# Altium project LED_12T-V2.0.PrjPCB
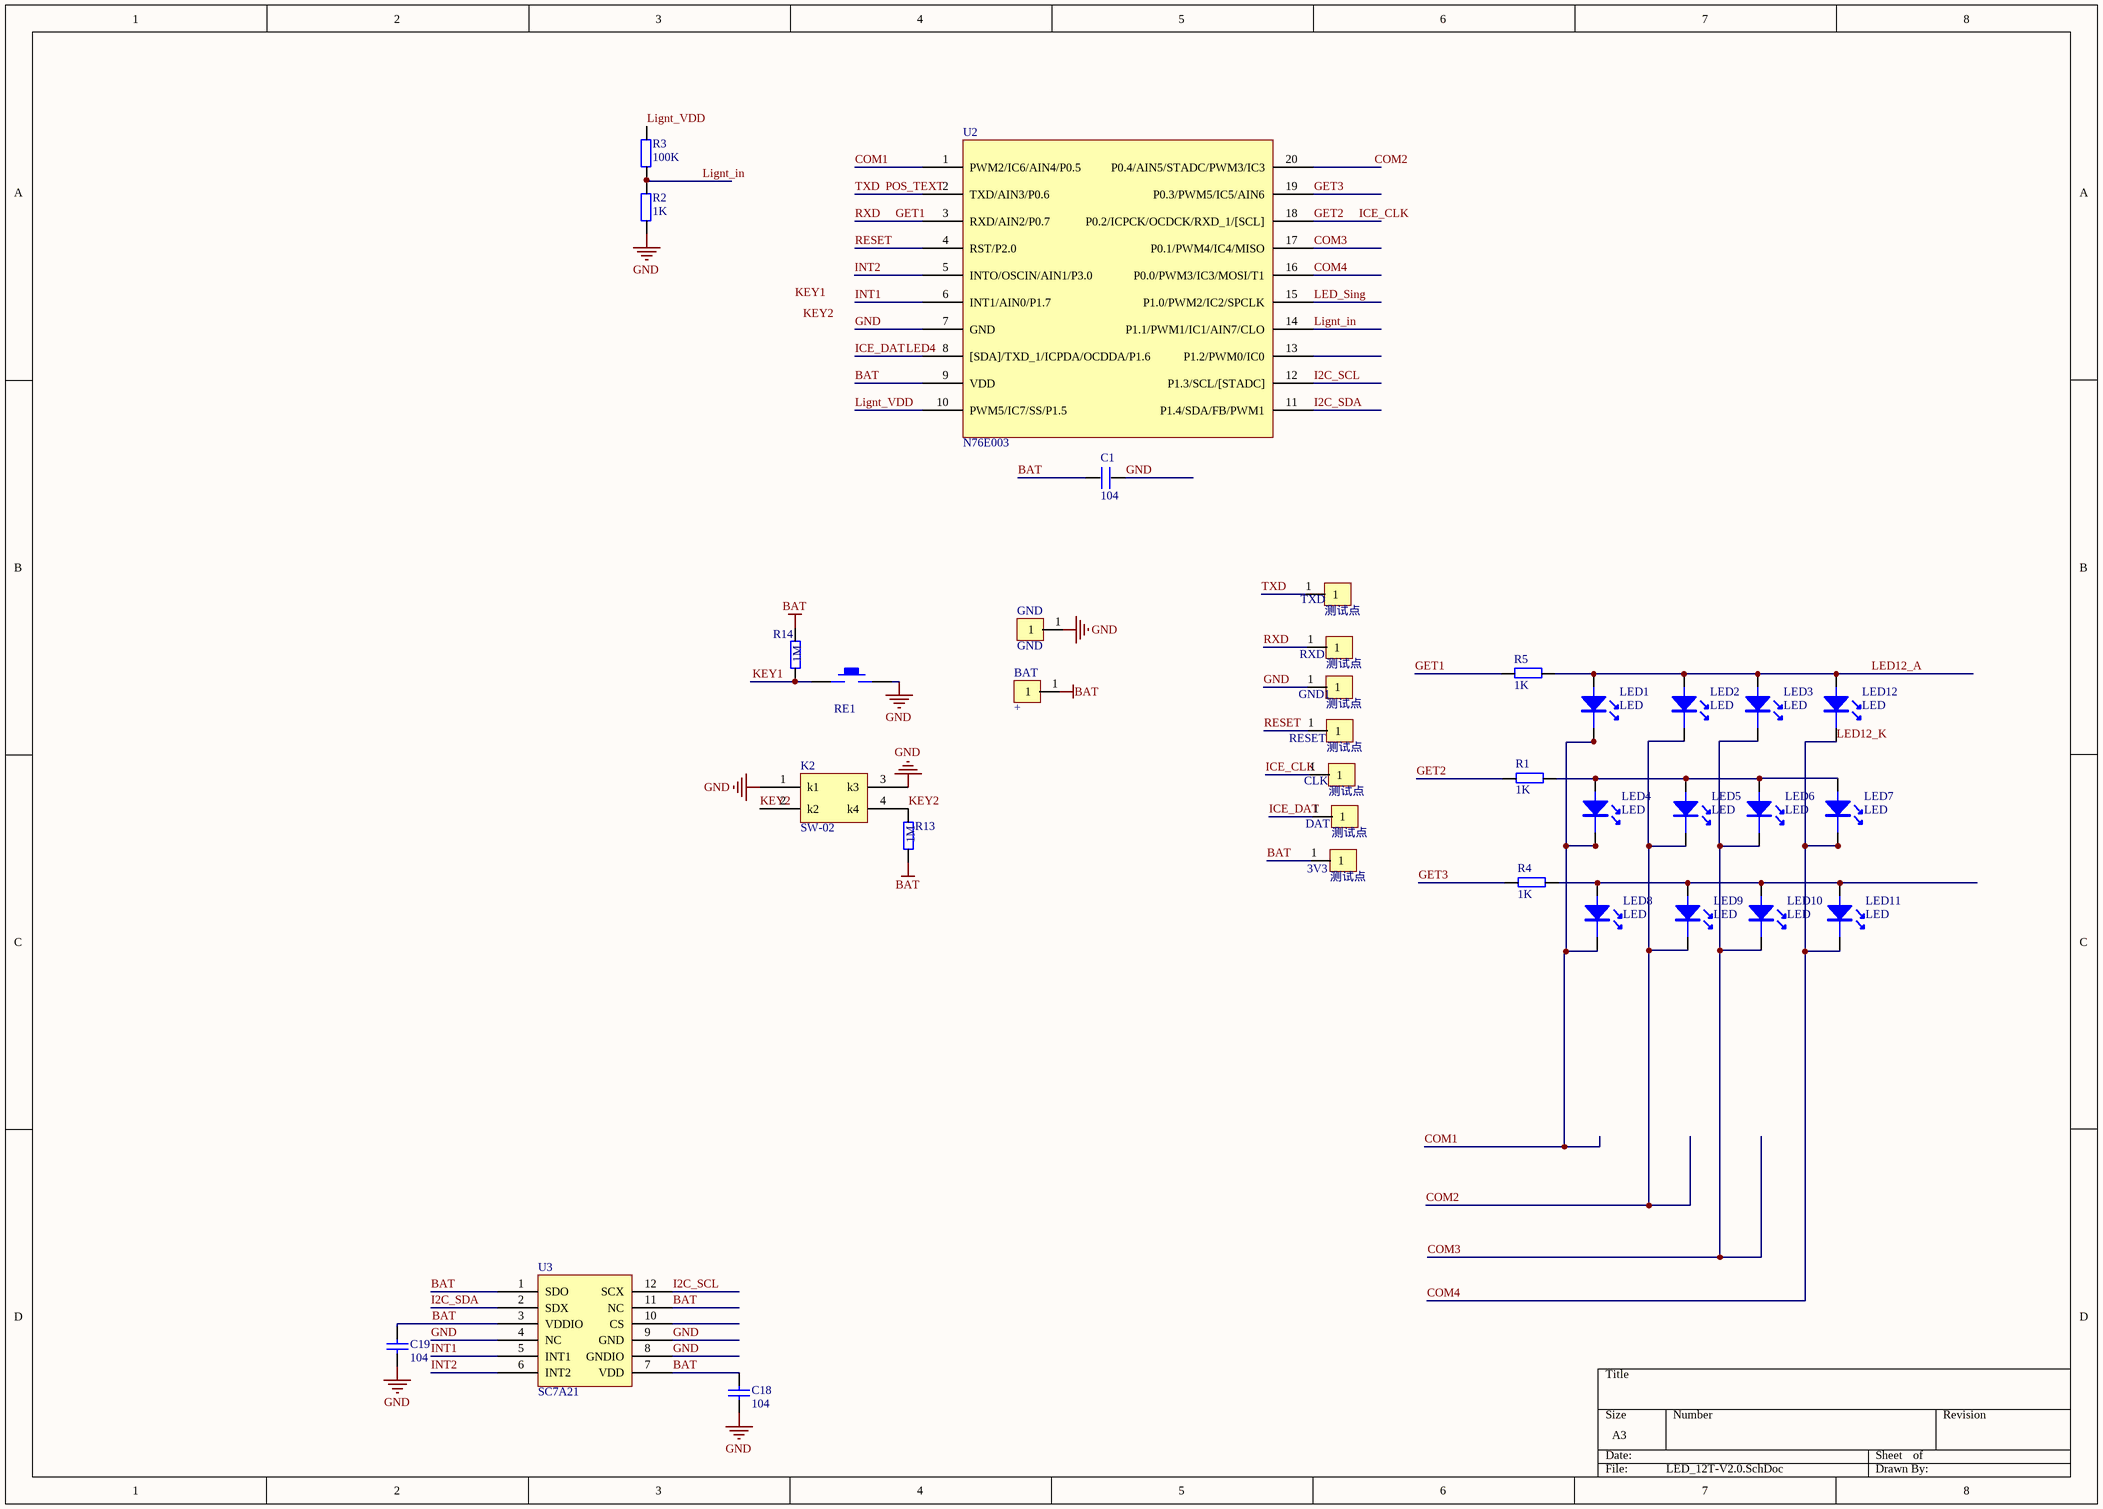
[diagram p0: LED_12T-V2.0.SchDoc]
1 sheet, 35 parts. Net scope: global (net labels, ports and power ports of the same name join across sheets).
Board file: LED_12T-V2.0.PcbDoc

## Sheet LED_12T-V2.0.SchDoc
size A3

### Parts
3V3  测试点  [测试点]
BAT  +  [CR2450_Z]
C1  104  [0603P]
C18  104  [0402_C]
C19  104  [0402_C]
CLK  测试点  [测试点]
DAT  测试点  [测试点]
GND  GND  [测试点]
GND1  测试点  [测试点]
K2  SW-02  [四向滚珠开关]
LED1  LED  [0402_LED]
LED2  LED  [0402_LED]
LED3  LED  [0402_LED]
LED4  LED  [0402_LED]
LED5  LED  [0402_LED]
LED6  LED  [0402_LED]
LED7  LED  [0402_LED]
LED8  LED  [0402_LED]
LED9  LED  [0402_LED]
LED10  LED  [0402_LED]
LED11  LED  [0402_LED]
LED12  LED  [0402_LED]
R1  1K  [0603_R]
R2  1K  [0603_R]
R3  100K  [0402_R]
R4  1K  [0603_R]
R5  1K  [0603_R]
R13  1M  [0402_R]
R14  1M  [0402_R]
RE1  KEY_M  [轻触开关 2x4]  (value not drawn)
RESET  测试点  [测试点]
RXD  测试点  [测试点]
TXD  测试点  [测试点]
U2  N76E003  [STSOP20]
U3  SC7A21  [LGA-12-2*2*1]

### Nets
BAT: 3V3.1 BAT.1 C1.2 C18.1 C19.1 R13.1 R14.2 U2.9(VDD) U3.1(SDO) U3.3(VDDIO) U3.7(VDD) U3.11(NC)
GND: C1.1 C18.2 C19.2 GND.1 GND1.1 K2.1(k1) K2.3(k3) R2.2 RE1.2 U2.7(GND) U3.4(NC) U3.8(GNDIO) U3.9(GND)
COM1: LED1.2(K) LED4.2(K) LED8.2(K) U2.1(PWM2/IC6/AIN4/P0.5)
COM2: LED2.2(K) LED5.2(K) LED9.2(K) U2.20(P0.4/AIN5/STADC/PWM3/IC3)
COM3: LED3.2(K) LED6.2(K) LED10.2(K) U2.17(P0.1/PWM4/IC4/MISO)
COM4: LED7.2(K) LED11.2(K) LED12.2(K) U2.16(P0.0/PWM3/IC3/MOSI/T1)  [also labelled LED12_K]
GET1: R5.2 RXD.1 U2.3(RXD/AIN2/P0.7)  [also labelled RXD]
GET2: CLK.1 R1.2 U2.18(P0.2/ICPCK/OCDCK/RXD_1/[SCL])  [also labelled ICE_CLK]
GET3: R4.2 U2.19(P0.3/PWM5/IC5/AIN6)
I2C_SCL: U2.12(P1.3/SCL/[STADC]) U3.12(SCX)
I2C_SDA: U2.11(P1.4/SDA/FB/PWM1) U3.2(SDX)
ICE_DAT: DAT.1 U2.8([SDA]/TXD_1/ICPDA/OCDDA/P1.6)  [also labelled LED4]
INT1: U2.6(INT1/AIN0/P1.7) U3.5(INT1)
INT2: U2.5(INTO/OSCIN/AIN1/P3.0) U3.6(INT2)
KEY1: R14.1 RE1.1
KEY2: K2.2(k2) K2.4(k4) R13.2
LED12_A: LED1.1(A) LED2.1(A) LED3.1(A) LED12.1(A) R5.1
LED_Sing: U2.15(P1.0/PWM2/IC2/SPCLK)
Lignt_in: R2.1 R3.2 U2.14(P1.1/PWM1/IC1/AIN7/CLO)
Lignt_VDD: R3.1 U2.10(PWM5/IC7/SS/P1.5)
POS_TEXT: TXD.1 U2.2(TXD/AIN3/P0.6)  [also labelled TXD]
RESET: RESET.1 U2.4(RST/P2.0)
NetLED4_1: LED4.1(A) LED5.1(A) LED6.1(A) LED7.1(A) R1.1
NetLED8_1: LED8.1(A) LED9.1(A) LED10.1(A) LED11.1(A) R4.1

Not connected (* = marked no-connect by the designer): U2 13(P1.2/PWM0/IC0); U3 10(CS)

### Notes on the sheet
- Labels drawn without touching a wire or pin: KEY1, KEY2

### Library data of the parts
BAT GND = 测试点
C1 = C
C18 C19 = Cap: Capacitor; Value: 10UF; Published: 8-Jun-2000; LatestRevisionDate: 17-Jul-2002; LatestRevisionNote: Re-released for DXP Platform.; PackageReference: RAD-0.3; Publisher: Altium Limited; PackageDescription: Radial Cap, Thru-Hole; 2 Leads; 0.3 in Pin Spacing
R1-R5 R13 R14 = R